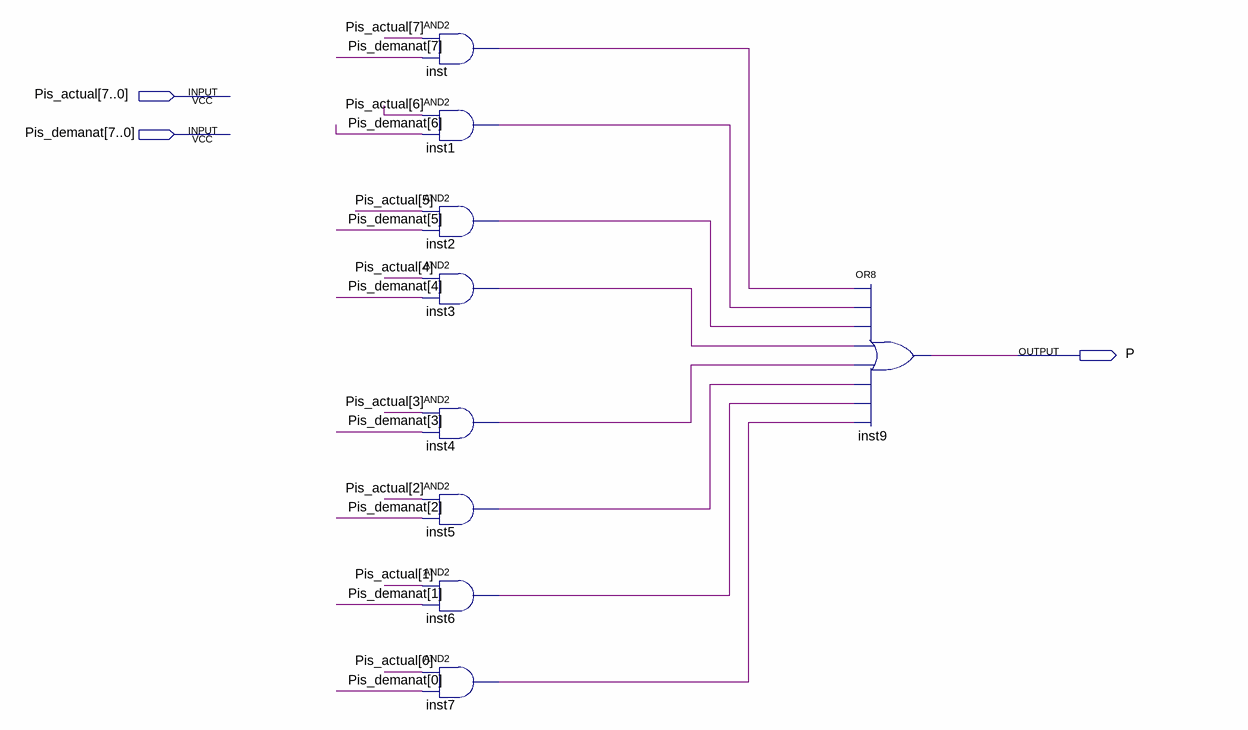
[diagram p0: schematic sheet]
// Quartus schematic Senyals_UC_P.bdf as structural Verilog: 9 symbols, 3 pins
module Senyals_UC_P (
  input  [7:0] Pis_actual,
  input  [7:0] Pis_demanat,
  output P
);

  wire inst1_out, inst2_out, inst3_out, inst4_out, inst5_out, inst6_out, inst7_out, inst_out;

  and inst (inst_out, Pis_actual[7], Pis_demanat[7]);
  and inst1 (inst1_out, Pis_actual[6], Pis_demanat[6]);
  and inst2 (inst2_out, Pis_actual[5], Pis_demanat[5]);
  and inst3 (inst3_out, Pis_actual[4], Pis_demanat[4]);
  and inst4 (inst4_out, Pis_actual[3], Pis_demanat[3]);
  and inst5 (inst5_out, Pis_actual[2], Pis_demanat[2]);
  and inst6 (inst6_out, Pis_actual[1], Pis_demanat[1]);
  and inst7 (inst7_out, Pis_actual[0], Pis_demanat[0]);
  or inst9 (P, inst_out, inst1_out, inst2_out, inst3_out, inst4_out, inst5_out, inst6_out, inst7_out);
endmodule
